# EAGLE design LeakSensor (EAGLE 9.1.3)
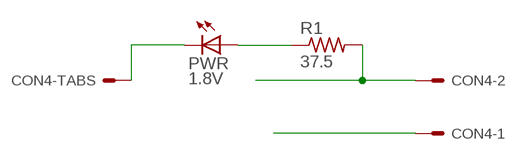
[diagram p0: schematic, sheet 1]

## Parts
CON4  SM02B-GHS-TB  [SM02B-GHS-TB]
PWR  1.8V  LEDSMT1206  [1206]
R1  37.5  R-US_R1206  [R1206]

## Nets
N$1: PWR.A R1.1
N$2: CON4.P$3 CON4.P$4 PWR.C
PATH: CON4.P$1
PATH1: CON4.P$2 R1.2

## Library data of the parts
CON4 = ARVP:SM02B-GHS-TB
PWR = adafruit:LED: LED OSRAM: - CHIPLED LG R971, LG N971, LY N971, LG Q971, LY Q971, LO R971, LY R971 LH N974, LH R974 LS Q976, LO Q976, LY Q976 LO Q996 - Hyper CHIPLED LW Q18S LB Q993, LB Q99A, LB R99A - SideLED LS A670, LO A670, LY A670, LG A670, LP A670 LB A673, LV A673, LT A673, LW A673 LH A674 LY A675 LS A676, LA A676, LO A676, LY A676, LW A676 LS A679, LY A679, LG A679 - Hyper Micro SIDELED® LS Y876, LA Y876, LO Y876, LY Y876 LT Y87S - SmartLED LW L88C, LW L88S LB L89C, LB L89S, LG L890 LS L89K, LO L89K, LY L89K LS L896, LA L896, LO L896, LY L896 - TOPLED LS T670, LO T670, LY T670, LG T670, LP T670 LSG T670, LSP T670, LSY T670, LOP T670, LYG T670 LG T671, LOG T671, LSG T671 LB T673, LV T673, LT T673, LW T673 LH T674 LS T676, LA T676, LO T676, LY T676, LB T676, LH T676, LSB T676, LW T676 LB T67C, LV T67C, LT T67C, LS T67K, LO T67K, LY T67K, LW E67C LS E67B, LA E67B, LO E67B, LY E67B, LB E67C, LV E67C, LT E67C LW T67C LS T679, LY T679, LG T679 LS T770, LO T770, LY T770, LG T770, LP T770 LB T773, LV T773, LT T773, LW T773 LH T774 LS E675, LA E675, LY E675, LS T675 LS T776, LA T776, LO T776, LY T776, LB T776 LHGB T686 LT T68C, LB T68C - Hyper Mini TOPLED® LB M676 - Mini TOPLED Santana® LG M470 LS M47K, LO M47K, LY M47K Source: http://www.osram.convergy.de/
R1 = resistor:R-US_: RESISTOR, American symbol

## Board
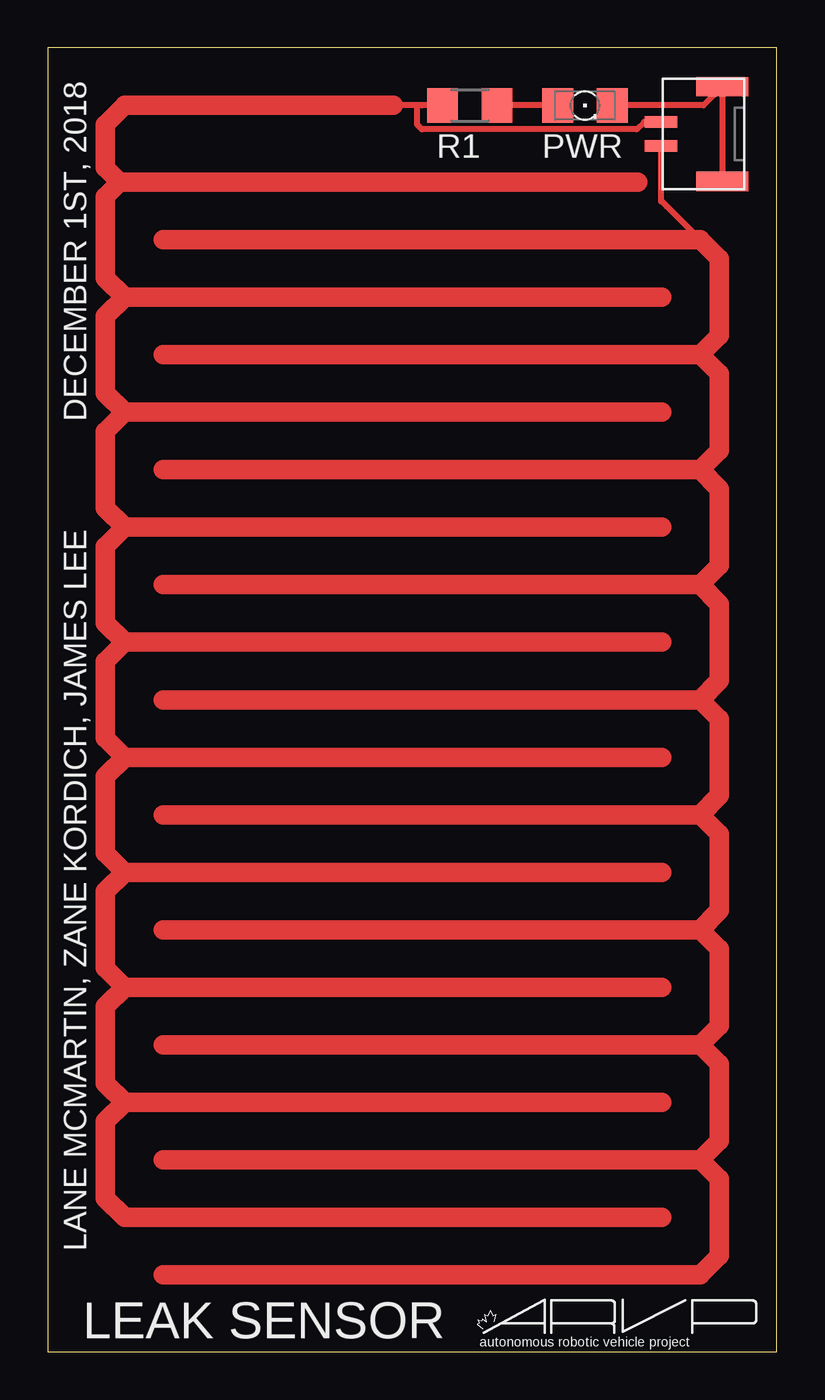
[diagram p1: board, top side]

Size 38 x 68 mm. Coordinates in mm from the lower left corner, seen from the top.
Outline: 0,0 38,0 38,68 0,68 0,0
Copper layers (1*16): Top 0.035mm / dielectric 1.5mm / Bottom 0.035mm
Design rules "JLCPCB2Layer": minimum track width 6mil, minimum drill 10mil, track to track 6mil, track to pad 6mil, pad to pad 6mil, via to via 6mil, smd to smd 0mil, copper to edge 10mil, drill to drill 10mil, minimum pad ring 6mil, minimum via ring 6mil, stop-mask expansion 2mil, vias tented up to drill 100mil, thermal gap 10mil

### Footprints (pad centres in the part's own frame; a part is rotated, then mirrored left to right if it is on the bottom)
SM02B-GHS-TB = smd 0.6 x 1.7: P$1 -0.625,0.85; P$2 0.625,0.85 | smd 1 x 2.7: P$3 -2.475,-2.35; P$4 2.475,-2.35
1206 = smd 1.6 x 1.803: A -1.422,0; C 1.422,0
R1206 = smd 1.6 x 1.803: 1 -1.422,0; 2 1.422,0

### Placement (x,y rotation side)
CON4  32.81,63.51 90 top
PWR  28,65 0 top
R1  22,65 180 top
U$1  [ARVP]  22.5,0.25 0 top

### Tracks (layer width: path | path; a pad name or v marks a point on that pad's centre or on a via)
N$1
  Top 0.3: PWR.A R1.1
N$2
  Top 0.3: PWR.C 34.17,65 CON4.P$4 CON4.P$3
PATH
  Top 0.152: 32,60 31.96,60
  Top 0.3: 34,58 32.27,59.73 32,60 | CON4.P$1 31.96,60
  Top 1.016: 34,52 35,53 35,57 34,58 32,58 6,58 | 34,52 35,51 35,47 34,46 | 34,46 6,46 | 34,52 6,52 | 34,46 35,45 35,41 34,40 | 34,40 6,40 | 34,40 35,39 35,35 34,34 | 34,34 6,34 | 34,34 35,33 35,29 34,28 | 34,28 6,28 | 34,28 35,27 35,23 34,22 | 34,22 6,22 | 34,22 35,21 35,17 34,16 | 34,16 6,16 | 34,16 35,15 35,11 34,10 | 34,10 6,10 | 34,10 35,9 35,5 34,4 6,4
PATH1
  Top 0.152: R1.2 21,64.58
  Top 0.3: R1.2 19.5,65 19.25,65 | CON4.P$2 31.08,64.14 30.7,63.75 19.5,63.75 19.25,64 19.25,65 | 19.25,65 18,65
  Top 1.016: 18,65 4,65 3,64 3,61.75 3.75,61 | 4,55 3,56 | 4,55 32,55 | 4,55 3,54 3,50 4,49 | 4,49 32,49 | 4,49 3,48 3,44 4,43 | 4,43 32,43 | 4,43 3,42 3,38 4,37 | 4,37 32,37 | 4,37 3,36 3,32 4,31 | 4,31 32,31 | 4,31 3,30 3,26 4,25 | 4,25 32,25 | 4,25 3,24 3,20 4,19 | 4,19 32,19 | 4,19 3,18 3,14 4,13 | 4,13 32,13 | 4,13 3,12 3,8 4,7 32,7 | 3.75,61 3,60.25 3,56 | 3.75,61 30.75,61 | 3,56

### Text on the board
tNames: LANE MCMARTIN, ZANE KORDICH, JAMES LEE DECEMBER 1ST, 2018 | LEAK SENSOR